# Altium schematic sheet 4G.SchDoc
size A3; Organization: Altium Limited; Address1: L3, 12a Rodborough Rd; Address2: Frenchs Forest; Address3: NSW; Address4: Australia 2086
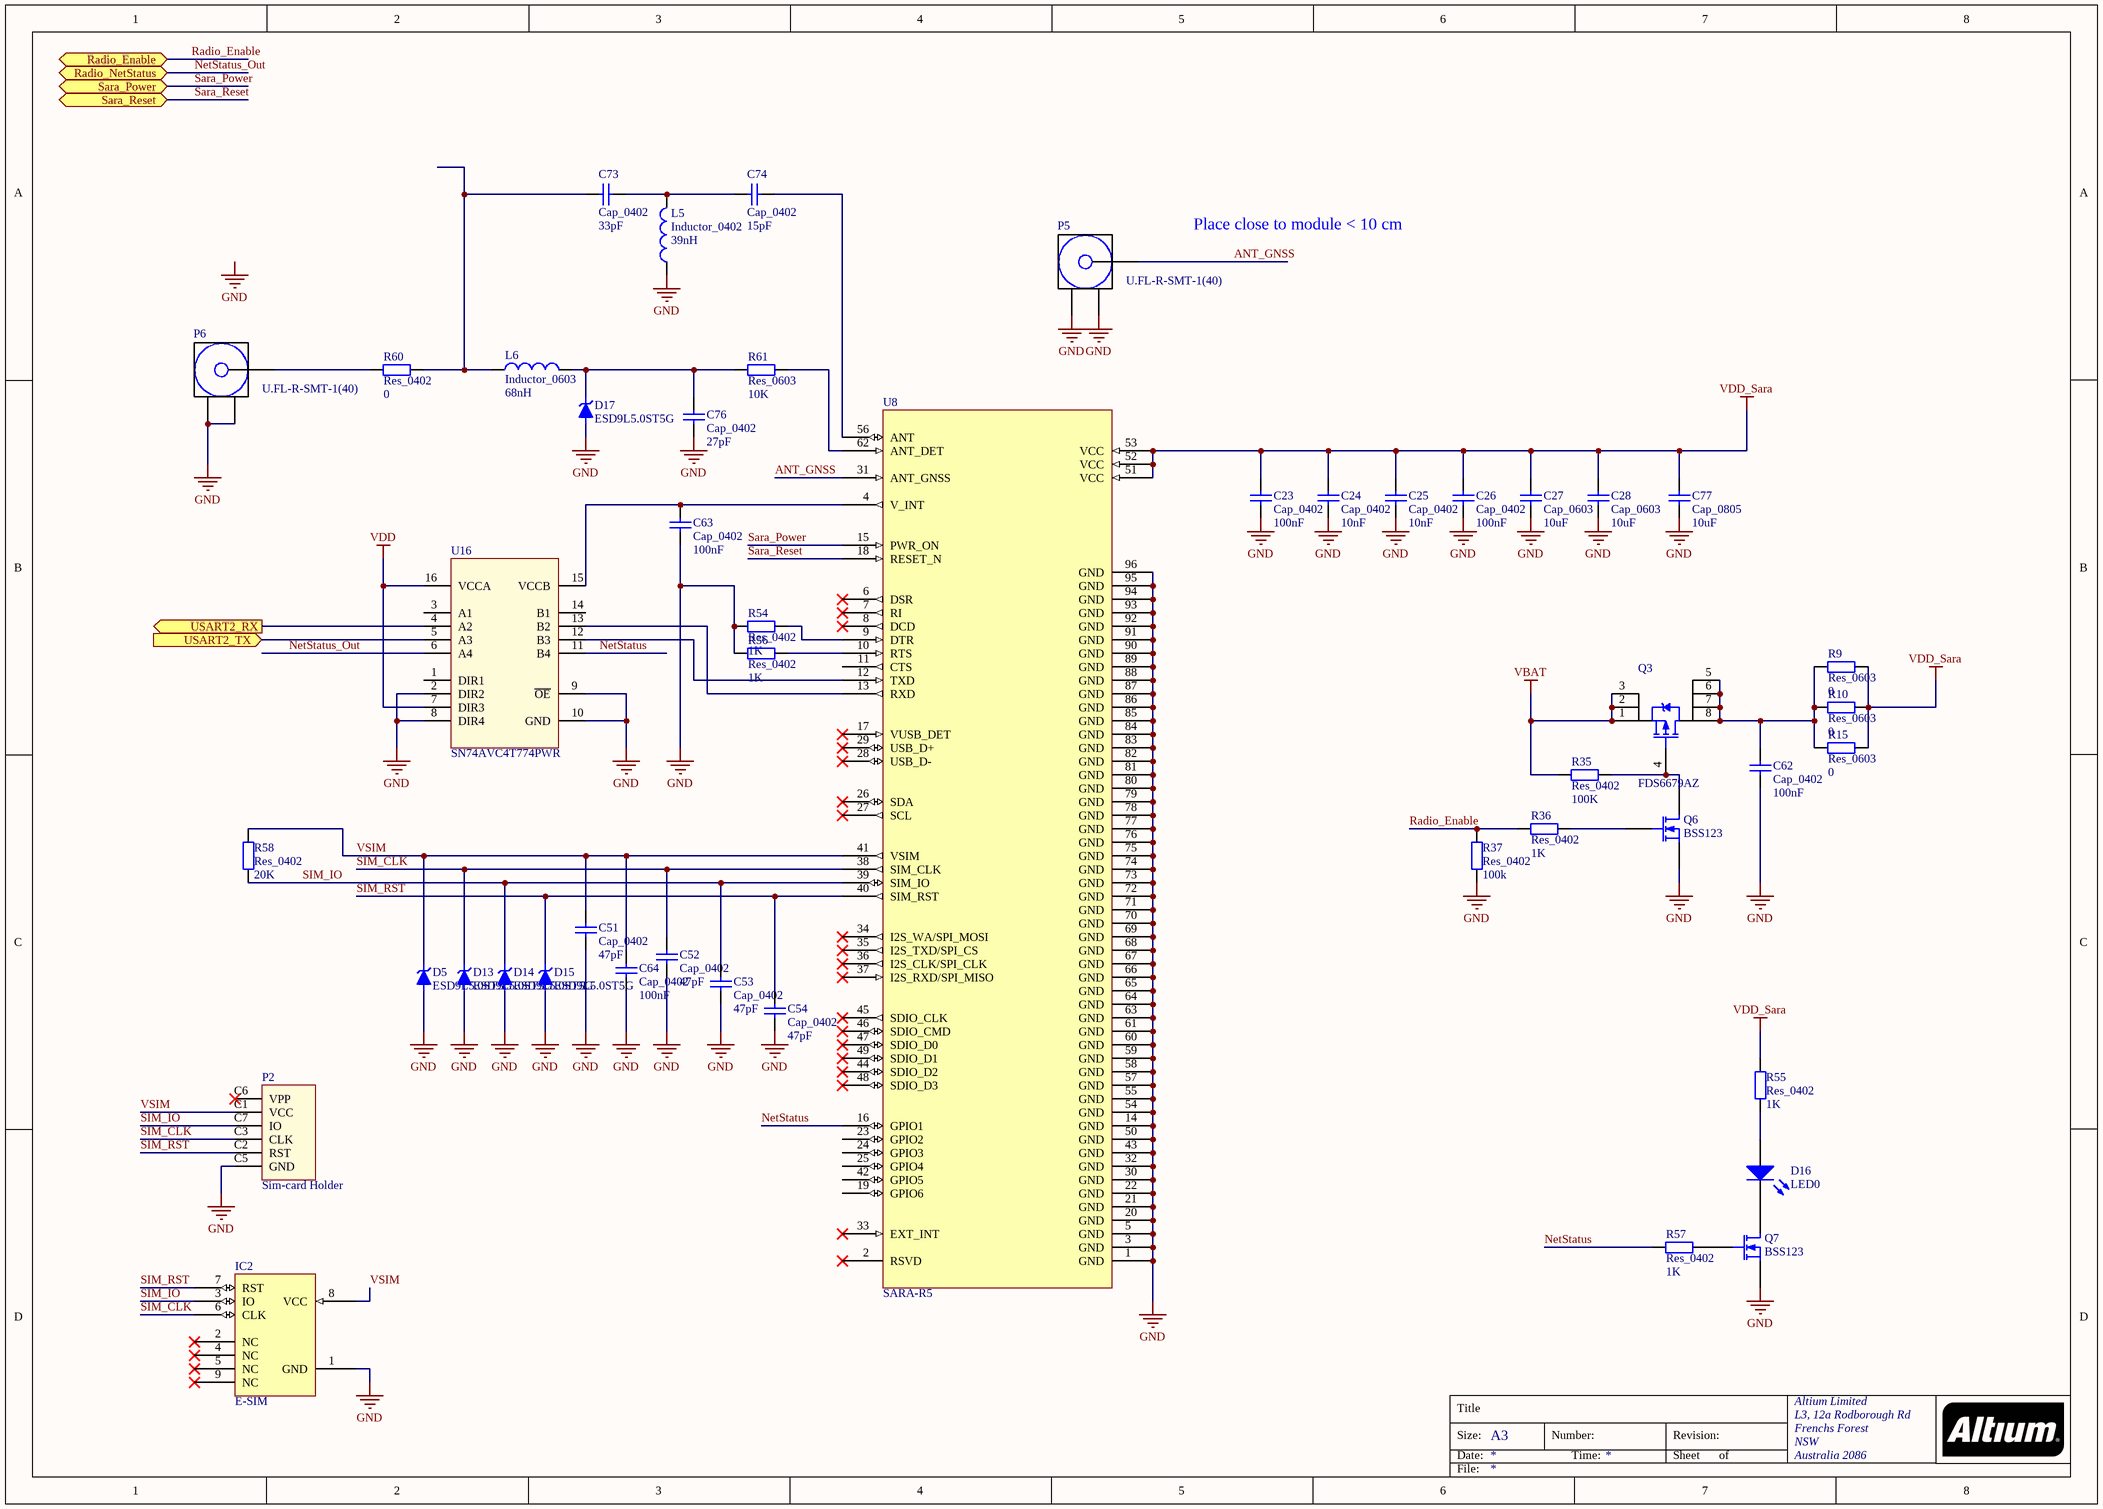
[diagram p0: 4G.SchDoc]

## Parts
C23  Cap_0402  value 100nF  [0402]
C24  Cap_0402  value 10nF  [0402]
C25  Cap_0402  value 10nF  [0402]
C26  Cap_0402  value 100nF  [0402]
C27  Cap_0603  value 10uF  [0603]
C28  Cap_0603  value 10uF  [0603]
C51  Cap_0402  value 47pF  [0402]
C52  Cap_0402  value 47pF  [0402]
C53  Cap_0402  value 47pF  [0402]
C54  Cap_0402  value 47pF  [0402]
C62  Cap_0402  value 100nF  [0402]
C63  Cap_0402  value 100nF  [0402]
C64  Cap_0402  value 100nF  [0402]
C73  Cap_0402  value 33pF  [0402]
C74  Cap_0402  value 15pF  [0402]
C76  Cap_0402  value 27pF  [0402]
C77  Cap_0805  value 10uF  [0805]
D5  ESD9L5.0ST5G  [SODFL100X40-2N]
D13  ESD9L5.0ST5G  [SODFL100X40-2N]
D14  ESD9L5.0ST5G  [SODFL100X40-2N]
D15  ESD9L5.0ST5G  [SODFL100X40-2N]
D16  LED0  [0603]
D17  ESD9L5.0ST5G  [SODFL100X40-2N]
IC2  E-SIM  [MFF2-ESIM]
L5  Inductor_0402  value 39nH  [0402]
L6  Inductor_0603  value 68nH  [0603]
P2  Sim-card Holder  [Sim-card Holder]
P5  U.FL-R-SMT-1(40)  [U.FL-R-SMT-1(40)]
P6  U.FL-R-SMT-1(40)  [U.FL-R-SMT-1(40)]
Q3  FDS6679AZ  [SOIC127P600X175-8N]
Q6  BSS123  [SOT-23]
Q7  BSS123  [SOT-23]
R9  Res_0603  value 0  [0603]
R10  Res_0603  value 0  [0603]
R15  Res_0603  value 0  [0603]
R35  Res_0402  value 100K  [0402]
R36  Res_0402  value 1K  [0402]
R37  Res_0402  value 100k  [0402]
R54  Res_0402  value 1K  [0402]
R55  Res_0402  value 1K  [0402]
R56  Res_0402  value 1K  [0402]
R57  Res_0402  value 1K  [0402]
R58  Res_0402  value 20K  [0402]
R60  Res_0402  value 0  [0402]
R61  Res_0603  value 10K  [0603]
U8  SARA-R5  [SARA-XX]
U16  SN74AVC4T774PWR  [TSOP65P640X120-16N]

## Ports
Radio_Enable (bidir), Radio_NetStatus (bidir), Sara_Power (bidir), Sara_Reset (bidir), USART2_RX (out), USART2_TX (in)

## Nets
GND: C23.1 C24.1 C25.1 C26.1 C27.1 C28.1 C51.1 C52.1 C53.1 C54.1 C62.1 C63.1 C64.1 C76.1 C77.1 D5.2 D13.2 D14.2 D15.2 D17.2 IC2.1(GND) L5.1 P2.C5(GND) P5.2 P5.3 P6.2 P6.3 Q6.2(S) Q7.2(S) R37.1 R54.1 R56.1 U8.1(GND) U8.3(GND) U8.5(GND) U8.14(GND) U8.20(GND) U8.21(GND) U8.22(GND) U8.30(GND) U8.32(GND) U8.43(GND) U8.50(GND) U8.54(GND) U8.55(GND) U8.57(GND) U8.58(GND) U8.59(GND) U8.60(GND) U8.61(GND) U8.63(GND) U8.64(GND) U8.65(GND) U8.66(GND) U8.67(GND) U8.68(GND) U8.69(GND) U8.70(GND) U8.71(GND) U8.72(GND) U8.73(GND) U8.74(GND) U8.75(GND) U8.76(GND) U8.77(GND) U8.78(GND) U8.79(GND) U8.80(GND) U8.81(GND) U8.82(GND) U8.83(GND) U8.84(GND) U8.85(GND) U8.86(GND) U8.87(GND) U8.88(GND) U8.89(GND) U8.90(GND) U8.91(GND) U8.92(GND) U8.93(GND) U8.94(GND) U8.95(GND) U8.96(GND) U16.2(DIR2) U16.8(DIR4) U16.9(~{OE}) U16.10(GND)
VBAT: Q3.1(S) Q3.2(S) Q3.3(S) R35.1
VDD: U16.7(DIR3) U16.16(VCCA)
VDD_Sara: C23.2 C24.2 C25.2 C26.2 C27.2 C28.2 C77.2 R9.2 R10.2 R15.2 R55.2 U8.51(VCC) U8.52(VCC) U8.53(VCC)
ANT_GNSS: P5.1 U8.31(ANT_GNSS)
NetStatus: R57.1 U8.16(GPIO1) U16.11(B4)
NetStatus_Out: U16.6(A4) ; port Radio_NetStatus
Radio_Enable: R36.1 R37.2 ; port Radio_Enable
Sara_Power: U8.15(PWR_ON) ; port Sara_Power
Sara_Reset: U8.18(RESET_N) ; port Sara_Reset
SIM_CLK: C52.2 D13.1 IC2.6(CLK) P2.C3(CLK) U8.38(SIM_CLK)
SIM_IO: C53.2 D14.1 IC2.3(IO) P2.C7(IO) R58.1 U8.39(SIM_IO)
SIM_RST: C54.2 D15.1 IC2.7(RST) P2.C2(RST) U8.40(SIM_RST)
USART2_RX: U16.4(A2) ; port USART2_RX
USART2_TX: U16.5(A3) ; port USART2_TX
VSIM: C51.2 C64.2 D5.1 IC2.8(VCC) P2.C1(VCC) R58.2 U8.41(VSIM)
NetC62_2: C62.2 Q3.5(D) Q3.6(D) Q3.7(D) Q3.8(D) R9.1 R10.1 R15.1
NetC63_2: C63.2 U8.4(V_INT) U16.15(VCCB)
NetC73_1: C73.1 C74.1 L5.2
NetC73_2: C73.2 L6.1 R60.2
NetC74_2: C74.2 U8.56(ANT)
NetC76_2: C76.2 D17.1 L6.2 R61.1
NetD16_1: D16.1(K) Q7.3(D)
NetD16_2: D16.2(A) R55.1
NetP6_1: P6.1 R60.1
NetQ3_4: Q3.4(G) Q6.3(D) R35.2
NetQ6_1: Q6.1(G) R36.2
NetQ7_1: Q7.1(G) R57.2
NetR54_2: R54.2 U8.9(DTR)
NetR56_2: R56.2 U8.10(RTS)
NetR61_2: R61.2 U8.62(ANT_DET)
NetU8_12: U8.12(TXD) U16.12(B3)
NetU8_13: U8.13(RXD) U16.13(B2)

Not connected (* = marked no-connect by the designer): IC2 2(NC)* 4(NC)* 5(NC)* 9(NC)*; P2 C6(VPP)*; U8 2(RSVD)* 6(DSR)* 7(RI)* 8(DCD)* 11(CTS) 17(VUSB_DET)* 19(GPIO6) 23(GPIO2) 24(GPIO3) 25(GPIO4) 26(SDA)* 27(SCL)* 28(USB_D-)* 29(USB_D+)* 33(EXT_INT)* 34(I2S_WA/SPI_MOSI)* 35(I2S_TXD/SPI_CS)* 36(I2S_CLK/SPI_CLK)* 37(I2S_RXD/SPI_MISO)* 42(GPIO5) 44(SDIO_D2)* 45(SDIO_CLK)* 46(SDIO_CMD)* 47(SDIO_D0)* 48(SDIO_D3)* 49(SDIO_D1)*; U16 1(DIR1) 3(A1) 14(B1)

## Notes on the sheet
- Place close to module < 10 cm
- Labels drawn without touching a wire or pin: GND
- Title
- Size:
- Date:
- A3
- Number:
- Time:
- Revision:
- Sheet
- of
- File:

## Library data of the parts
C23-C26 C51-C54 C62-C64 C73 C74 C76 = Cap_0402: Capacitor; Published: 8-Jun-2000; LatestRevisionDate: 17-Jul-2002; LatestRevisionNote: Re-released for DXP Platform.; PackageReference: RAD-0.3; Publisher: Altium Limited; PackageDescription: Radial Cap, Thru-Hole; 2 Leads; 0.3 in Pin Spacing
C27 C28 = Cap_0603: Capacitor; Published: 8-Jun-2000; LatestRevisionDate: 17-Jul-2002; LatestRevisionNote: Re-released for DXP Platform.; PackageReference: RAD-0.3; Publisher: Altium Limited; PackageDescription: Radial Cap, Thru-Hole; 2 Leads; 0.3 in Pin Spacing
C77 = Cap_0805: Capacitor; Published: 8-Jun-2000; LatestRevisionDate: 17-Jul-2002; LatestRevisionNote: Re-released for DXP Platform.; PackageReference: RAD-0.3; Publisher: Altium Limited; PackageDescription: Radial Cap, Thru-Hole; 2 Leads; 0.3 in Pin Spacing
D5 D13-D15 D17 = ESD9L5-0ST5G: TVS_ESD9L5-0ST5G
D16 = LED0: Typical INFRARED GaAs LED; Published: 8-Jun-2000; LatestRevisionDate: 08-Jul-2005; LatestRevisionNote: Mech Layer 1 removed.; PackageReference: LED-0; Publisher: Altium Limited; PackageDescription: LED; 2 Leads
L5 = Inductor_0402: Inductor
L6 = Inductor_0603: Inductor
P2 = Sim-card Holder: 788000001_Molex
P5 P6 = RF-Connector
Q3 = FDS6679AZ: Transistor, FET
Q6 Q7 = BSS123: N-Channel MOSFET; Published: 8-Jun-2000; LatestRevisionDate: 17-Jul-2002; LatestRevisionNote: Re-released for DXP Platform.; PackageVersion: 1995/1996; PackageReference: E3; Publisher: Altium Limited; PackageDescription: TO, Flat Index; 3 In-Line, Axial Leads; Body Dia. 4.6mm; Lead Dia. 0.5 mm (max)
R9 R10 R15 R61 = Res_0603: Resistor; Published: 8-Jun-2000; LatestRevisionDate: 17-Jul-2002; LatestRevisionNote: Re-released for DXP Platform.; PackageReference: AXIAL-0.4; Publisher: Altium Limited; PackageDescription: Axial Device, Thru-Hole; 2 Leads; 0.4 in Pin Spacing
R35-R37 R54-R58 R60 = Res_0402: Resistor; Published: 8-Jun-2000; LatestRevisionDate: 17-Jul-2002; LatestRevisionNote: Re-released for DXP Platform.; PackageReference: AXIAL-0.4; Publisher: Altium Limited; PackageDescription: Axial Device, Thru-Hole; 2 Leads; 0.4 in Pin Spacing
U16 = SN74AVC4T774PWR: Buffer